# EasyEDA schematic 1-Schematic_Antenna Mini-Whip (TH).json

## Sheets
1 Antenna Mini-Whip (TH): Main module: TITLE: Antenna Mini-Whip (TH): Main module; REV: 6.9.EE; Date: 2019-05-24; Sheet: 1/3; Drawn By: IgrikXD
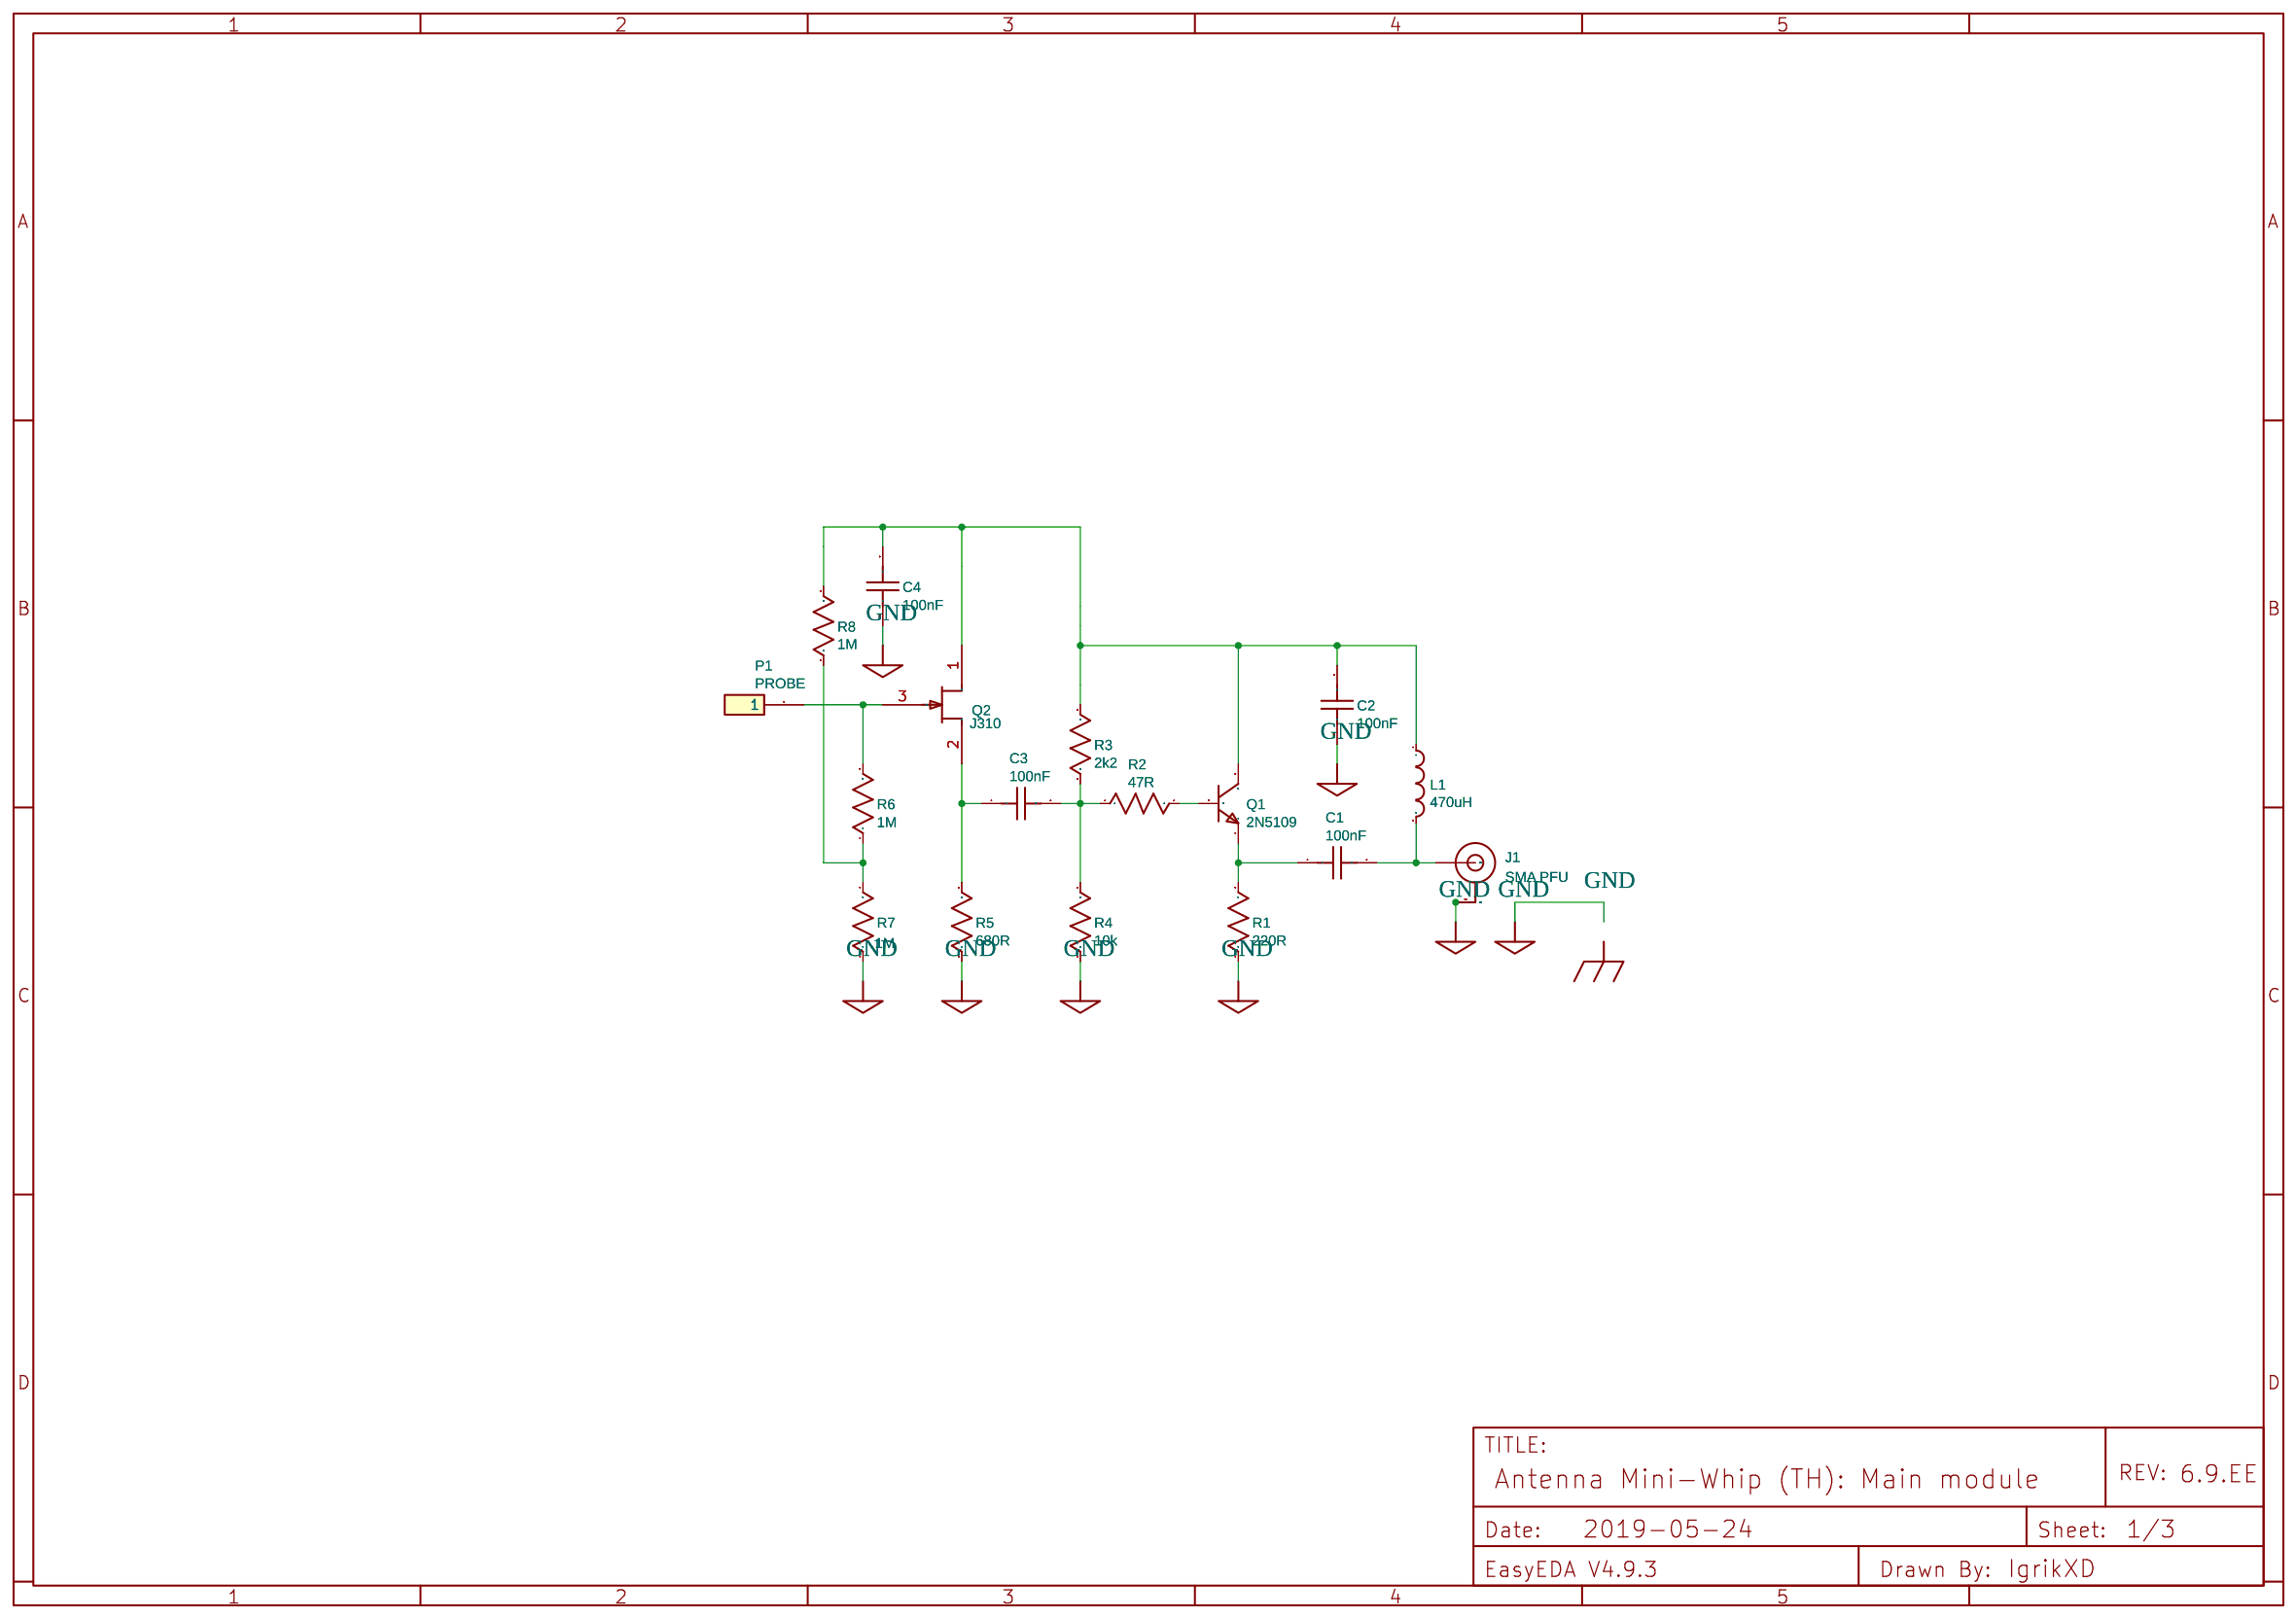
[diagram p0: Antenna Mini-Whip (TH): Main module]
2 Antenna Mini-Whip (TH): Power feed unit: TITLE: Antenna Mini-Whip (TH): Power feed unit; Sheet: 2/3
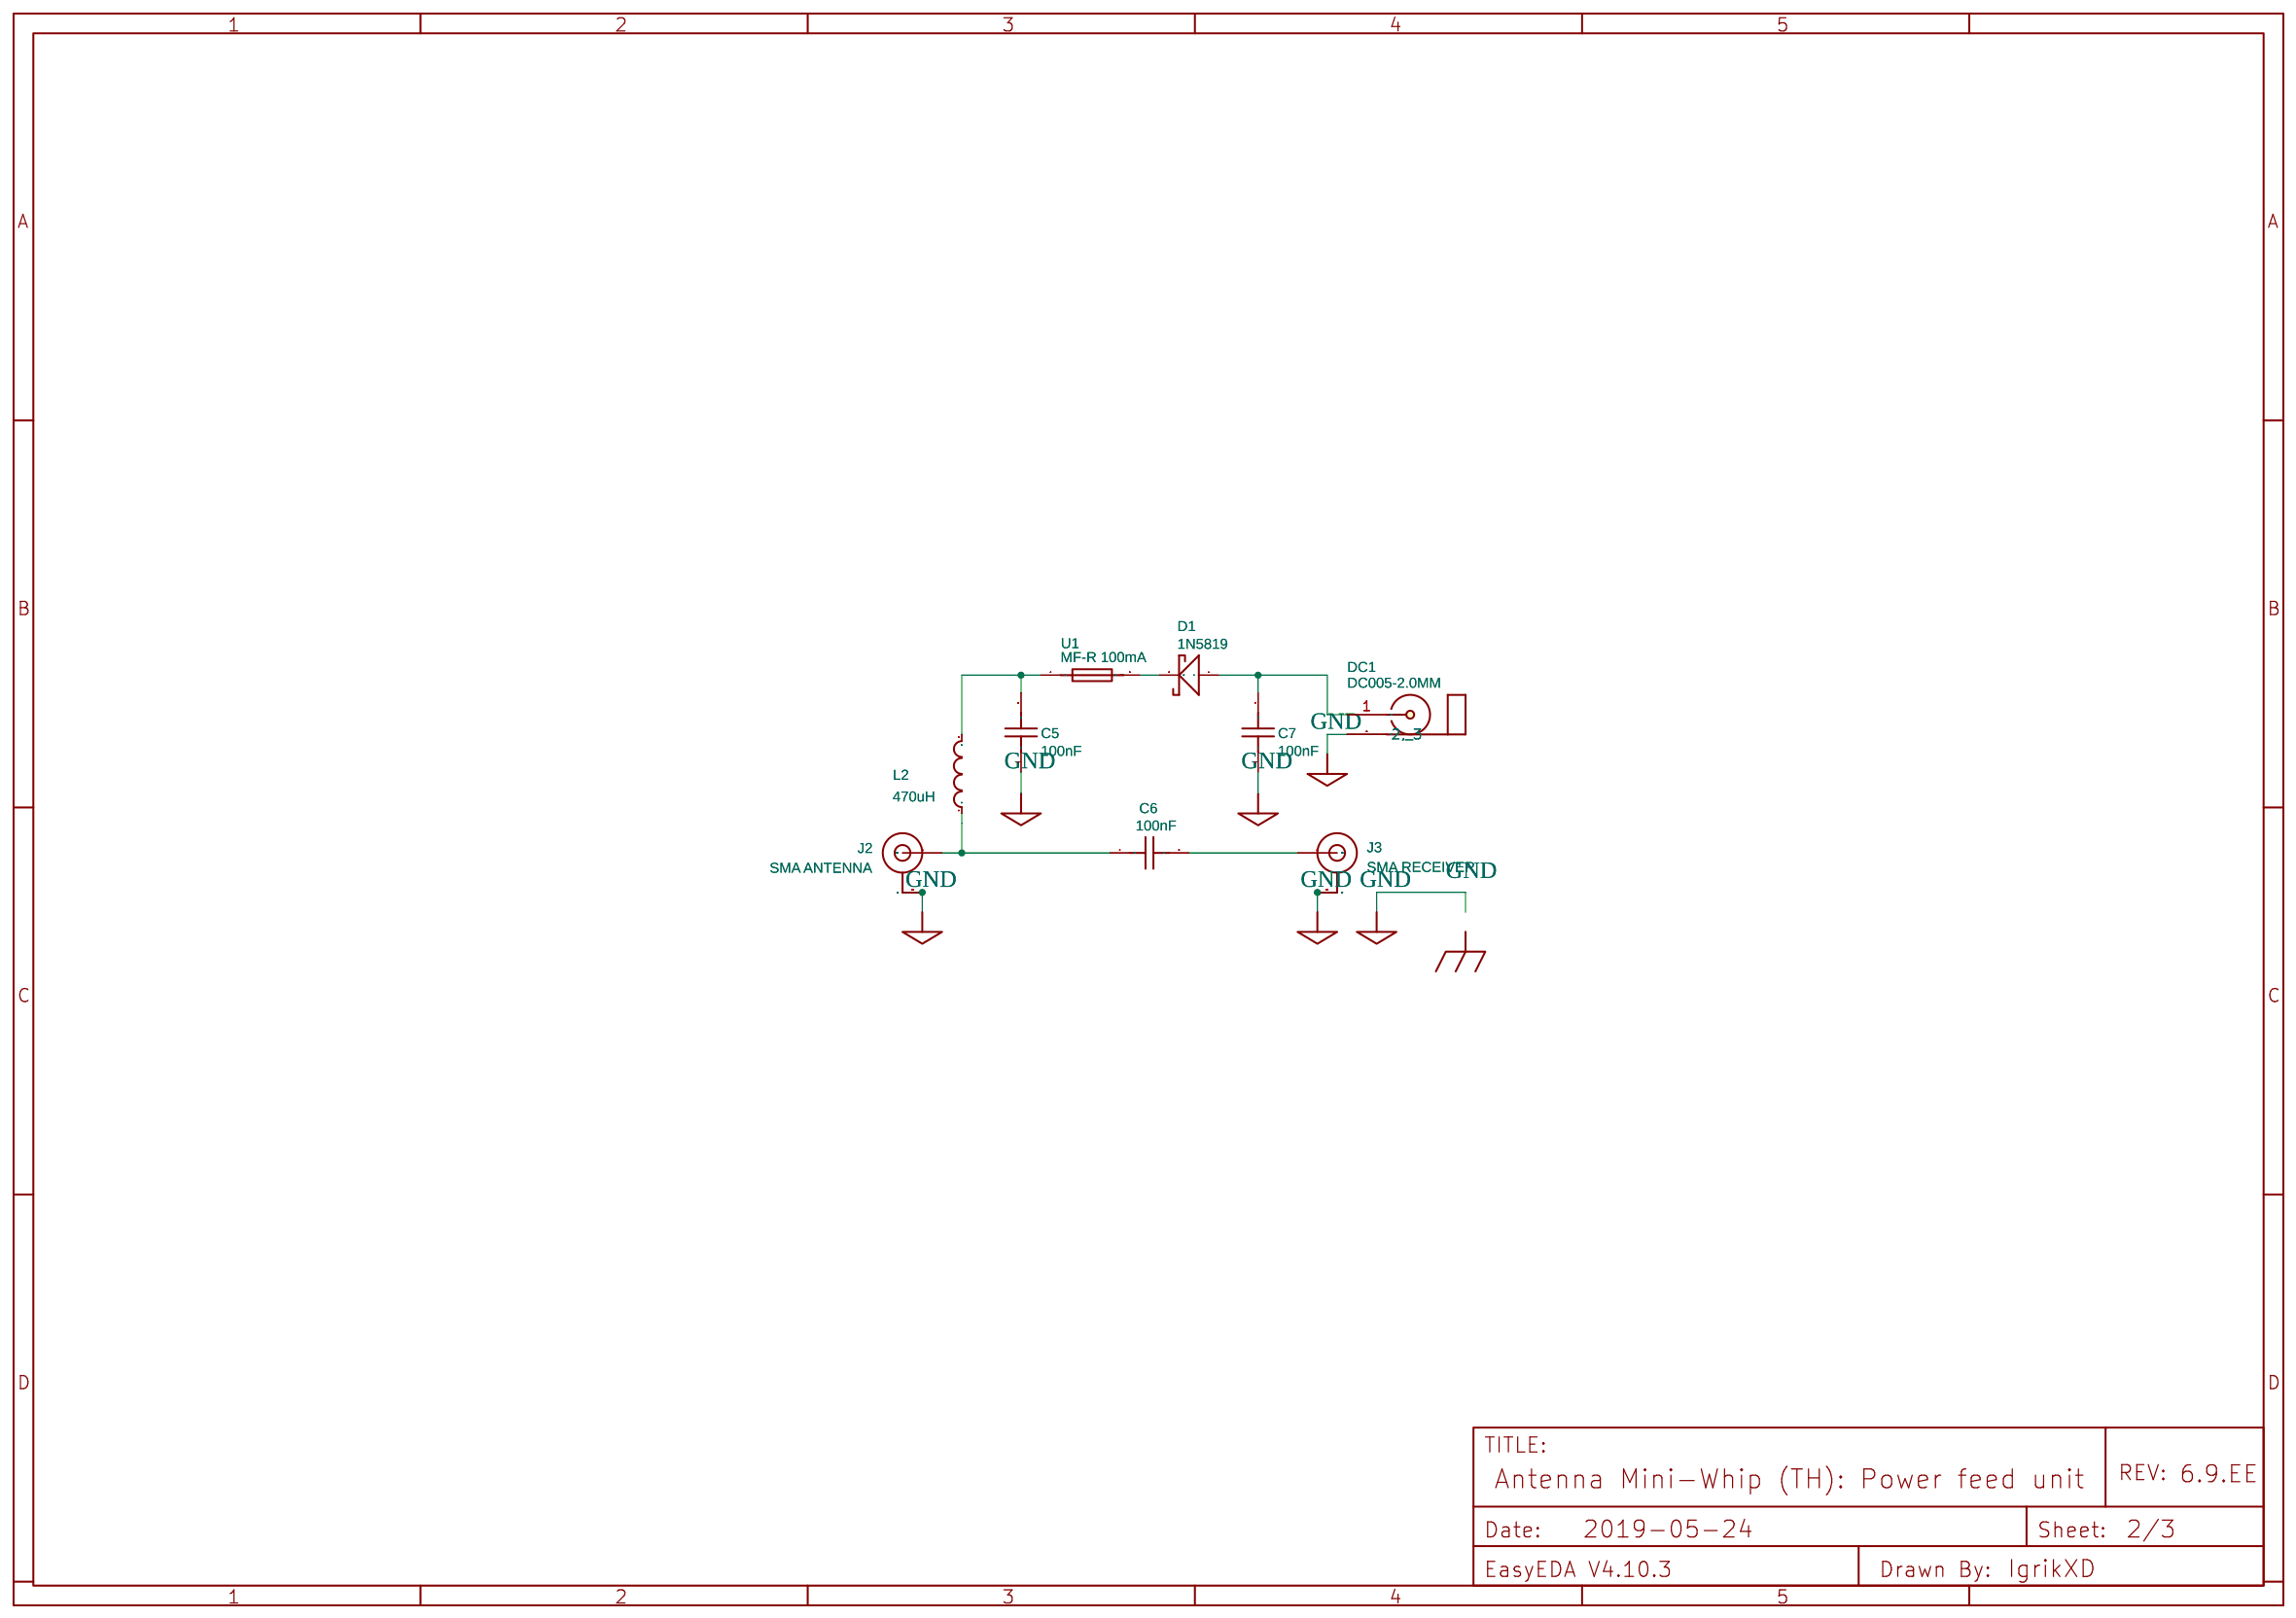
[diagram p1: Antenna Mini-Whip (TH): Power feed unit]
3 Antenna Mini-Whip (TH): Power feed unit (with RF-isolation transformer): TITLE: Antenna Mini-Whip (TH): Power feed unit (with RF-isolation transformer); Sheet: 3/3
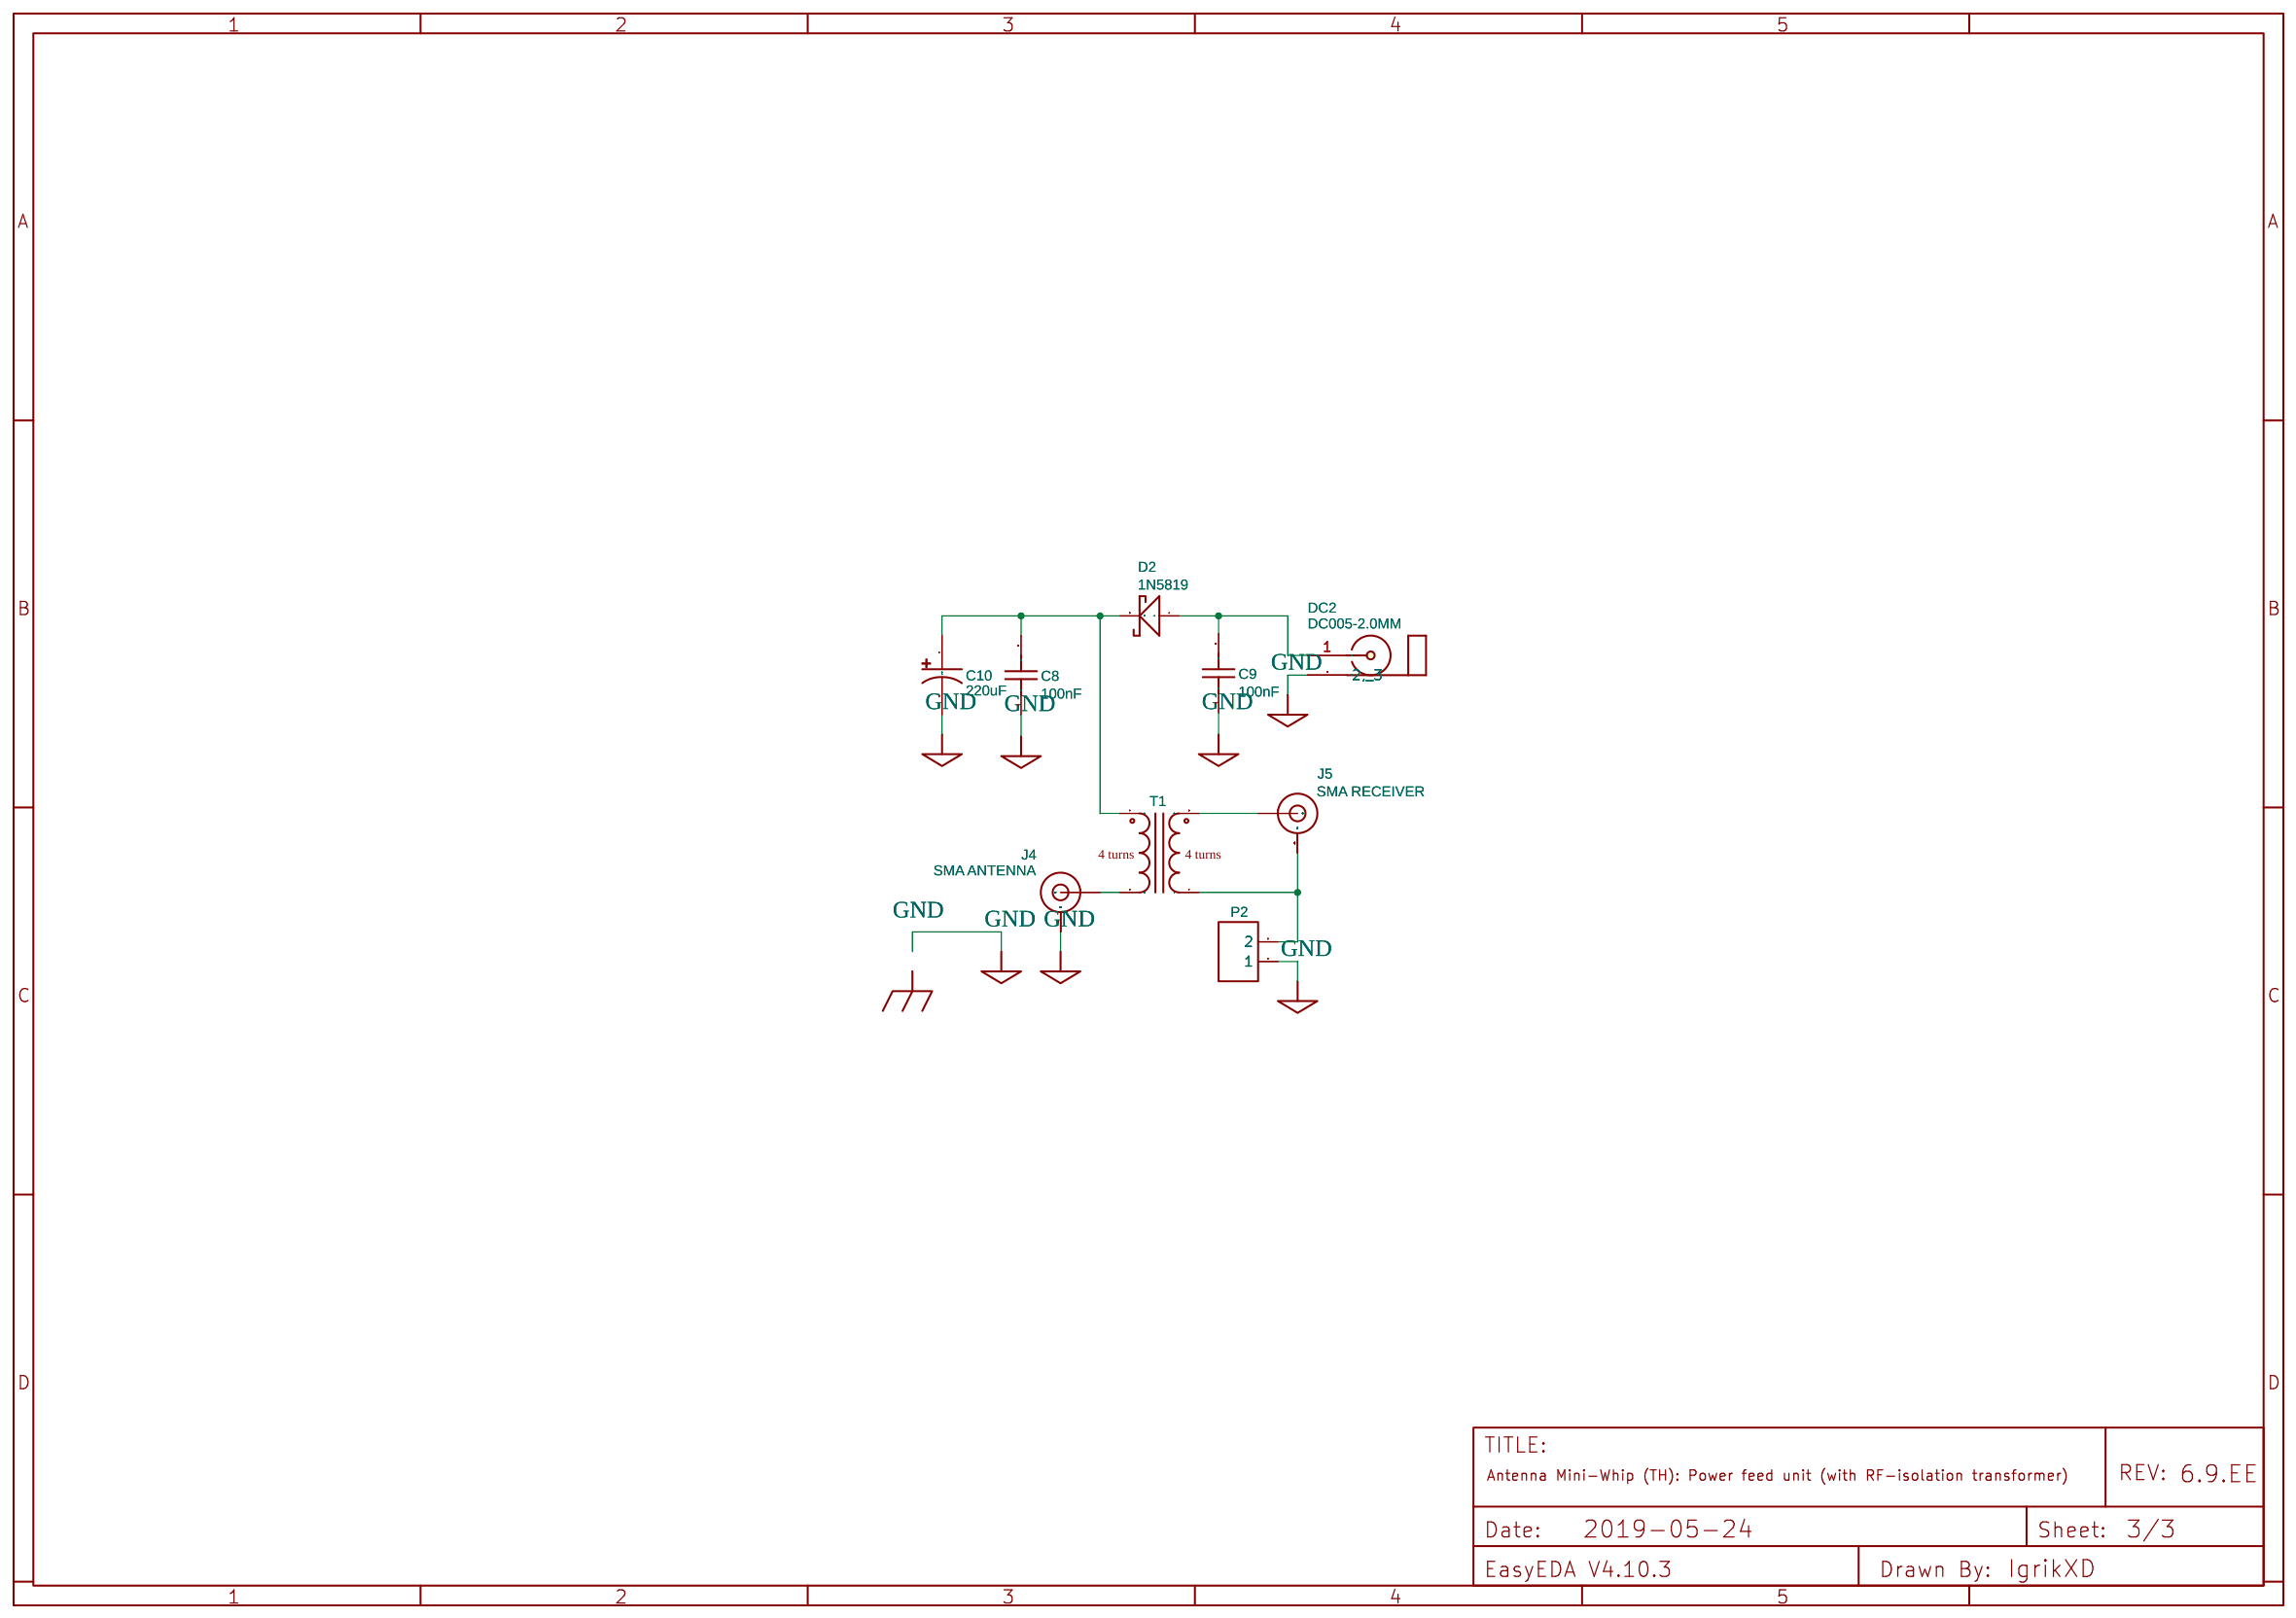
[diagram p2: Antenna Mini-Whip (TH): Power feed unit (with RF-isolation transformer)]

## Parts
sheet Antenna Mini-Whip (TH): Main module
C1  100nF  [RAD-0.1]
C2  100nF  [RAD-0.1]
C3  100nF  [RAD-0.1]
C4  100nF  [RAD-0.1]
J1  SMA PFU  [SMA-EDGE]
L1  470uH  [AXIAL-0.4]
P1  PROBE  [HDR-1X1/2.54]
Q1  2N5109  [TO39]
Q2  J310  [TO92-INLINE]
R1  220R  [AXIAL-0.5]
R2  47R  [AXIAL-0.3]
R3  2k2  [AXIAL-0.3]
R4  10k  [AXIAL-0.3]
R5  680R  [AXIAL-0.3]
R6  1M  [AXIAL-0.3]
R7  1M  [AXIAL-0.3]
R8  1M  [AXIAL-0.3]
sheet Antenna Mini-Whip (TH): Power feed unit (with RF-isolation transformer)
C8  100nF  [RAD-0.1]
C9  100nF  [RAD-0.1]
C10  220uF  [CAP-D6.3XF2.5]
D2  1N5819  [DO41-7]
DC2  DC005-2.0MM  [DC-5020]
J4  SMA ANTENNA  [SMA-EDGE]
J5  SMA RECEIVER  [SMA-EDGE]
P2  Header-Female-2.54_1x2  [HDR-2X1/2.54]
T1  XFMR
sheet Antenna Mini-Whip (TH): Power feed unit
C5  100nF  [RAD-0.1]
C6  100nF  [RAD-0.1]
C7  100nF  [RAD-0.1]
D1  1N5819  [DO41-7]
DC1  DC005-2.0MM  [DC-5020]
J2  SMA ANTENNA  [SMA-EDGE]
J3  SMA RECEIVER  [SMA-EDGE]
L2  470uH  [AXIAL-0.4]
U1  MF-R 100mA  [F-0.10A-60V]

## Library data of the parts
C1-C9 = Capacitor: Manufacturer Part: Monolithic0805B104J500F3; Supplier: LCSC; Manufacturer: FH; Supplier Part: C110282
J1-J3 = -: SMA Antenna Connector; catid: 20; Contributor: Pinoccio; Manufacturer Part: ANKX01.0093; Supplier: LCSC; Manufacturer: RFsister; Supplier Part: C129604
L1 L2 = Inductor: Manufacturer Part: LGA0510-471KP52E; Supplier: LCSC; Manufacturer: FH; Supplier Part: C72362
P1 = -: Supplier: LCSC; Manufacturer: LCSC; Manufacturer Part: Header-Male-2.54_1x1; Mounted: No; Supplier Part: C81276
Q1 = -: NPN General Purpose Amplifier; catid: 20; Supplier: Digi-Key; Manufacturer: Central Semiconductor Corp; Supplier Part: 2N5109CS-ND
Q2 = -: catid: 20; Supplier: Digi-Key; Manufacturer: ON Semiconductor; Supplier Part: J310-ND
R1 = Resistor: Manufacturer Part: MFR0S2F2200A20; Supplier: LCSC; Manufacturer: Uniroyal Elec; Supplier Part: C58583
R2 = Resistor: Manufacturer Part: MF1/4W-47Ω±1% T52; Supplier: LCSC; Manufacturer: CCO; Supplier Part: C119296
R3 = Resistor: Manufacturer Part: MFR0W4F2201A50; Supplier: LCSC; Manufacturer: UniOhm; Supplier Part: C58595
R4 = Resistor: Manufacturer Part: MFR0W4F1002A50; Supplier: LCSC; Manufacturer: UniOhm; Supplier Part: C57436
R5 = Resistor: Manufacturer Part: MFR0W4F6800A50; Supplier: LCSC; Manufacturer: UniOhm; Supplier Part: C58599
R6-R8 = Resistor: Manufacturer Part: MFR0W4F1004A50; Supplier: LCSC; Manufacturer: UniOhm; Supplier Part: C58596
C10 = Cap_Electrolytic(TH)_D6.3XF2.5_US: Manufacturer Part: NULL; Supplier: LCSC; Supplier Part: C43838; Manufacturer: Dongguan Chengxing Elec
D2 = -: Contributor: IgrikXD; Supplier: LCSC; Supplier Part: C2474; Manufacturer: (MDD) Jiangsu Yutai Elec
DC1 DC2 = -: Supplier Part: C16214; Supplier: LCSC; Manufacturer: BOOMELE; Manufacturer Part: DC-005 5.5-2.0; Contributor: IgrikXD
J4 J5 = -: SMA Antenna Connector; Contributor: IgrikXD; Manufacturer Part: ANKX01.0093; Supplier: LCSC; Supplier Part: C129604; Manufacturer: RFsister
P2 = -: Supplier: LCSC; Manufacturer: TE Connectivity; Manufacturer Part: 826629-2; Supplier Part: C86471
T1 = TRANSFORMER_US: Supplier Part: NULL; Supplier: Handmade; Contributor: EasyEDA; Manufacturer Part: NULL; Manufacturer: NULL
D1 = -: Contributor: IgrikXD; Manufacturer: (MDD) Jiangsu Yutai Elec; Supplier: LCSC; Supplier Part: C2474
U1 = -: Supplier: LCSC; Manufacturer: BOURNS; Manufacturer Part: MF-R010; Contributor: IgrikXD; Supplier Part: C89660

## Nets
GND: C2.1 C4.1 C5.1 C7.1 C8.1 C9.1 C10.2 DC1.2(2, 3) DC1.3 DC2.2(2, 3) DC2.3 J1.GND@0(GND) J1.GND@1(GND) J1.GND@2(GND) J1.GND@3(GND) J2.GND@0(GND) J2.GND@1(GND) J2.GND@2(GND) J2.GND@3(GND) J3.GND@0(GND) J3.GND@1(GND) J3.GND@2(GND) J3.GND@3(GND) J4.GND@0(GND) J4.GND@1(GND) J4.GND@2(GND) J4.GND@3(GND) P2.1 R1.1 R4.1 R5.1 R7.1
Net-(C1-1): C1.1 Q1.1(E) R1.2
Net-(C1-2): C1.2 J1.SIG(SIGNAL) L1.2
Net-(C2-2): C2.2 C4.2 L1.1 Q1.3(C) Q2.1(D) R3.2 R8.2
Net-(C3-1): C3.1 Q2.2(S) R5.2
Net-(C3-2): C3.2 R2.1 R3.1 R4.2
Net-(C5-2): C5.2 L2.2 U1.1
Net-(C6-1): C6.1 J2.SIG(SIGNAL) L2.1
Net-(C6-2): C6.2 J3.SIG(SIGNAL)
Net-(C7-2): C7.2 D1.A DC1.1(VCC)
Net-(C8-2): C8.2 C10.1 D2.C T1.1
Net-(C9-2): C9.2 D2.A DC2.1(VCC)
Net-(D1-C): D1.C U1.2
Net-(J4-SIG): J4.SIG(SIGNAL) T1.2
Net-(J5-GND@0): J5.GND@0(GND) J5.GND@1(GND) J5.GND@2(GND) J5.GND@3(GND) P2.2 T1.4
Net-(J5-SIG): J5.SIG(SIGNAL) T1.3
Net-(P1-1): P1.1 Q2.3(G) R6.2
Net-(Q1-2): Q1.2(B) R2.2
Net-(R6-1): R6.1 R7.2 R8.1
